# Altium schematic sheet STC智能车.SchDoc
size A2
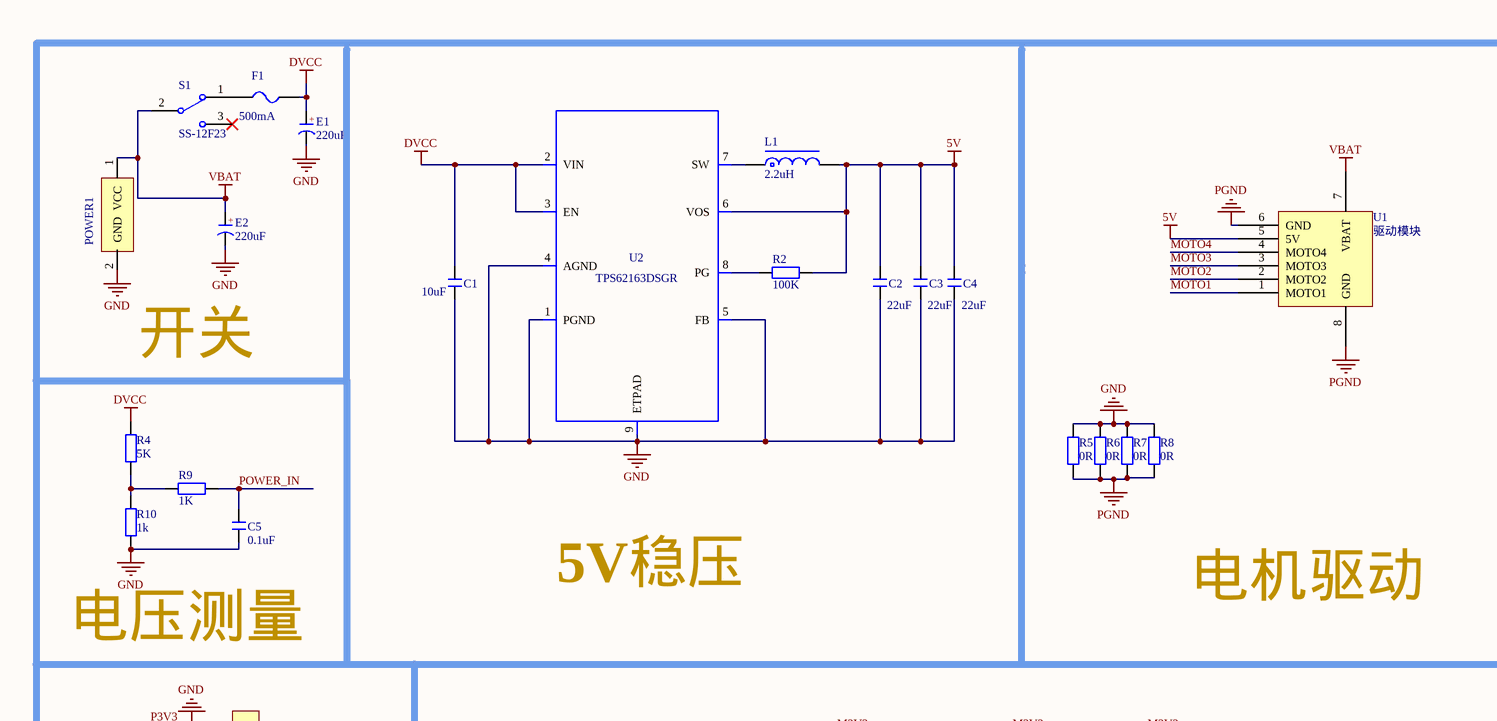
[diagram p0: STC智能车.SchDoc, top left]
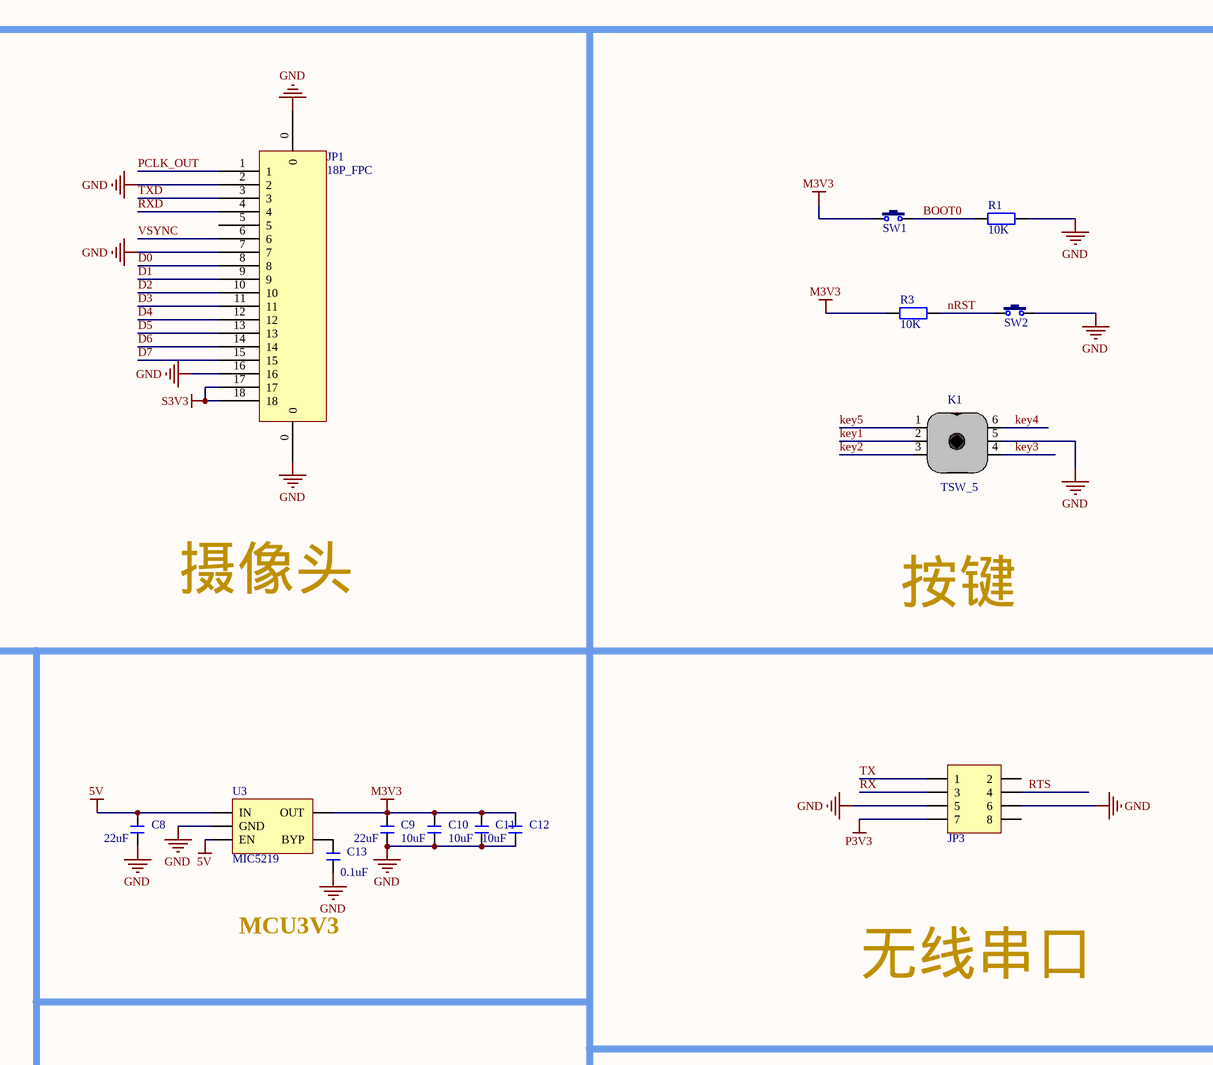
[diagram p1: STC智能车.SchDoc, top right]
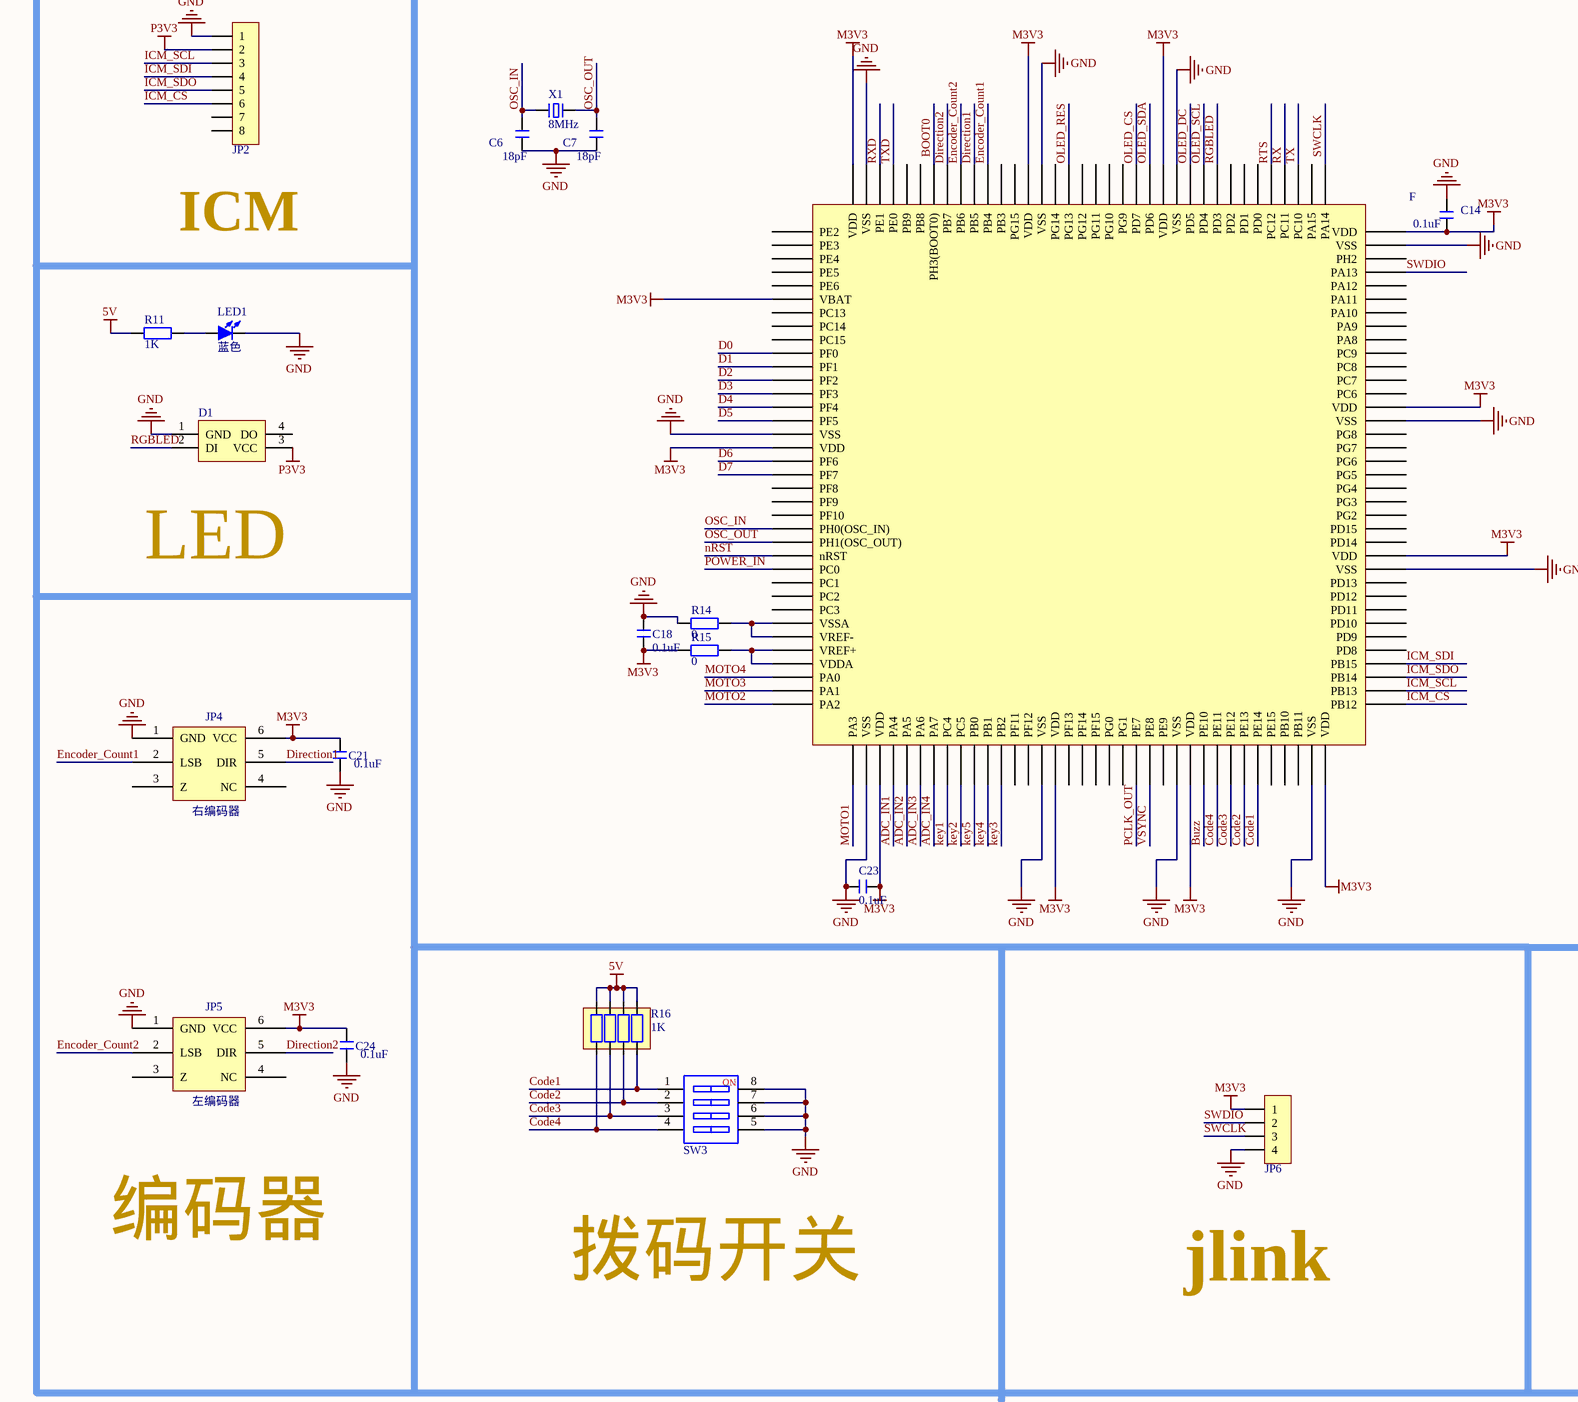
[diagram p2: STC智能车.SchDoc, bottom left]
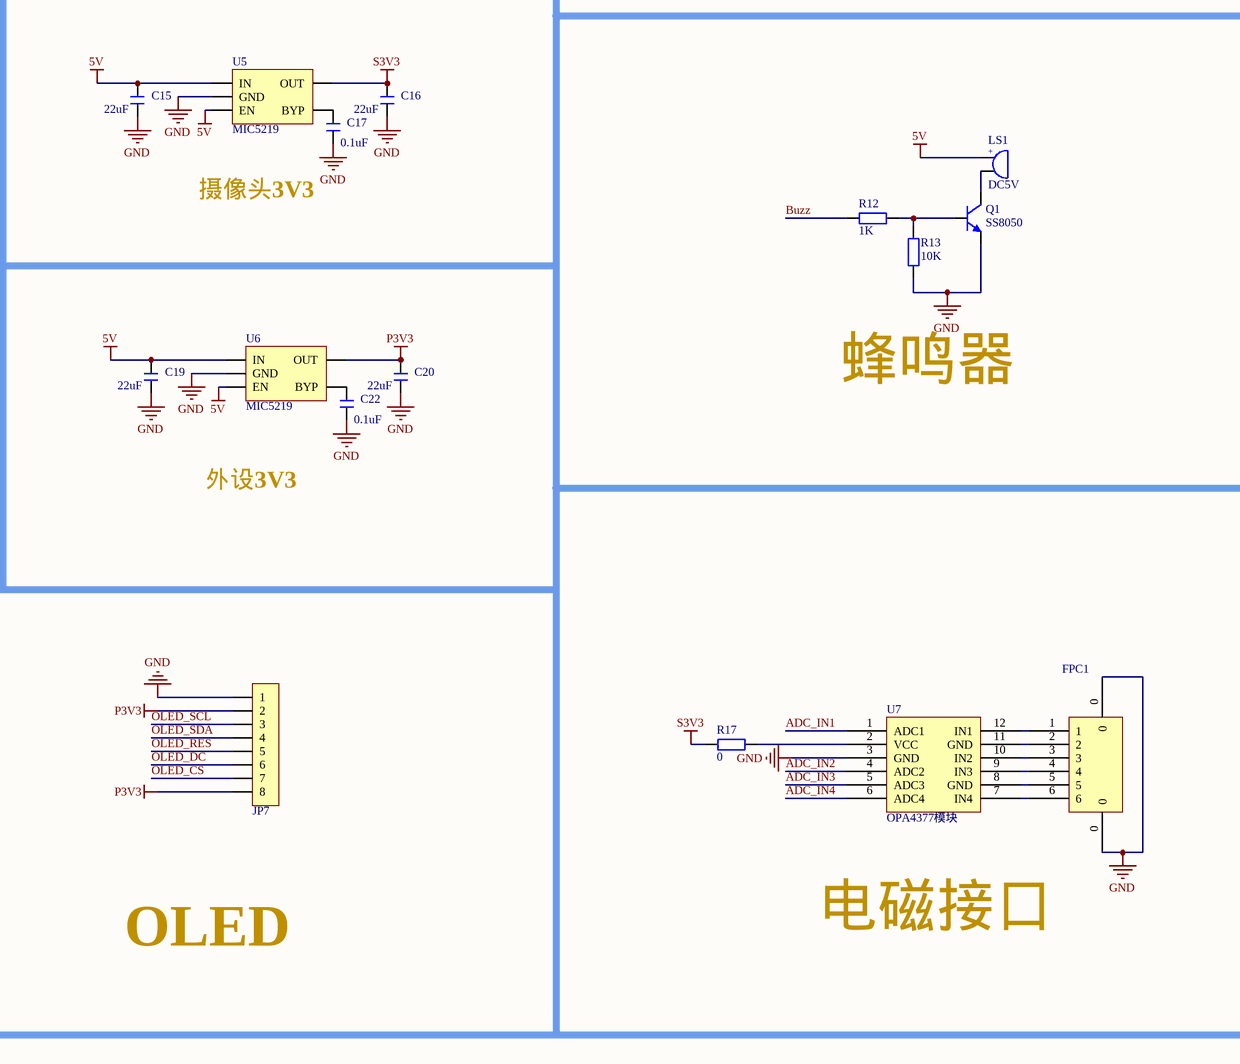
[diagram p3: STC智能车.SchDoc, bottom right]

## Parts
C1  10uF  [C 0805_M]
C2  22uF  [C 0805_M]
C3  22uF  [C 0805_M]
C4  22uF  [C 0805_M]
C5  0.1uF  [C 0805_M]
C6  18pF  [C 0805_M]
C7  18pF  [C 0805_M]
C8  22uF  [C 0805_M]
C9  22uF  [C 0805_M]
C10  10uF  [C 0805_M]
C11  10uF  [C 0805_M]
C12  10uF  [C 0805_M]
C13  0.1uF  [C 0805_M]
C14  0.1uF  [C 0805_M]
C15  22uF  [C 0805_M]
C16  22uF  [C 0805_M]
C17  0.1uF  [C 0805_M]
C18  0.1uF  [C 0805_M]
C19  22uF  [C 0805_M]
C20  22uF  [C 0805_M]
C21  0.1uF  [C 0805_M]
C22  0.1uF  [C 0805_M]
C23  0.1uF  [C 0805_M]
C24  0.1uF  [C 0805_M]
D1  P923D  [RGB_LED_5050]  (value not drawn)
E1  220uF  [CD D(7343)]
E2  220uF  [CD D(7343)]
F  MM32F3277  [LQFP144 20X20_M]  (value not drawn)
F1  500mA  [FU 0805]
FPC1  FPC_6PIN  [FPC0.5 2H-WS-6P]  (value not drawn)
JP1  18P_FPC  [FPC0.5 2H-WS-18P]
JP2  HDR-1X8  [XH2.54-WI-8P]  (value not drawn)
JP3  Header 4X2  [HDR2.54-LI-2x4P]  (value not drawn)
JP4  右编码器  [2*3牛插座]
JP5  左编码器  [2*3牛插座]
JP6  HDR-1X4  [XH2.54-WI-4P]  (value not drawn)
JP7  HDR-1X8  [IPS]  (value not drawn)
K1  TSW_5  [TSW-10]
L1  2.2uH  [CD52]
LED1  蓝色  [LED 0805B]
LS1  DC5V  [BEEP 5x9x5.5]
POWER1  (no value)  [T槽]
Q1  SS8050  [SOT23-3N]
R1  10K  [R 0805_M]
R2  value 100K  [R 0805_M]  (hidden comment: Res2)
R3  10K  [R 0805_M]
R4  value 5K  [R 0805_M]  (hidden comment: Res2)
R5  0R  [R 0805_M]
R6  0R  [R 0805_M]
R7  0R  [R 0805_M]
R8  0R  [R 0805_M]
R9  value 1K  [R 0805_M]  (hidden comment: Res2)
R10  value 1k  [R 0805_M]  (hidden comment: Res2)
R11  value 1K  [R 0805_M]  (hidden comment: Res2)
R12  1K  [R 0805_L]
R13  10K  [R 0805_L]
R14  0  [R 0805_M]
R15  0  [R 0805_M]
R16  1K  [RCA-8P4R-0603]
R17  0  [R 0805_L]
S1  SS-12F23  [SS-12D10]
SW1  3x6x5  [TSW SMD-3*6*2.5]  (value not drawn)
SW2  3x6x5  [TSW SMD-3*6*2.5]  (value not drawn)
SW3  SW-4P  [CSW DIP-4P]  (value not drawn)
U1  驱动模块  [电机驱动]
U2  TPS62163DSGR  [TPS62163]
U3  MIC5219  [SOT23-5M]
U5  MIC5219  [SOT23-5M]
U6  MIC5219  [SOT23-5M]
U7  OPA4377模块  [OPA4377模块]
X1  8MHz  [OSC 5032-2P]

## Nets
5V: C2.2 C3.2 C4.2 C8.2 C15.2 C19.2 L1.2 LS1.1 R2.1 R11.2 R16.5 R16.6 R16.7 R16.8 U1.5(5V) U2.6(VOS) U3.1(IN) U3.3(EN) U5.1(IN) U5.3(EN) U6.1(IN) U6.3(EN)
DVCC: C1.2 E1.1(A) F1.2 R4.2 U2.2(VIN) U2.3(EN)
GND: C1.1 C2.1 C3.1 C4.1 C5.1 C6.1 C7.1 C8.1 C9.1 C10.1 C11.1 C12.1 C13.1 C14.2 C15.1 C16.1 C17.1 C18.1 C19.1 C20.1 C21.1 C22.1 C23.1 C24.1 D1.1(GND) E1.2(K) E2.2(K) F.16(VSS) F.38(VSS) F.51(VSS) F.61(VSS) F.71(VSS) F.83(VSS) F.94(VSS) F.107(VSS) F.120(VSS) F.130(VSS) F.143(VSS) FPC1.0 JP1.0 JP1.2 JP1.7 JP1.16 JP2.1 JP3.5 JP3.6 JP4.1(GND) JP5.1(GND) JP6.4 JP7.1 K1.5 LED1.2(K) POWER1.2(GND) Q1.2(E) R1.2 R5.2 R6.2 R7.2 R8.2 R10.1 R13.1 R14.2 SW2.2 SW3.5 SW3.6 SW3.7 SW3.8 U2.1(PGND) U2.4(AGND) U2.5(FB) U2.9(ETPAD) U3.2(GND) U5.2(GND) U6.2(GND) U7.3(GND)
M3V3: C9.2 C10.2 C11.2 C12.2 C14.1 C18.2 C21.2 C23.2 C24.2 F.6(VBAT) F.17(VDD) F.39(VDD) F.52(VDD) F.62(VDD) F.72(VDD) F.84(VDD) F.95(VDD) F.108(VDD) F.121(VDD) F.131(VDD) F.144(VDD) JP4.6(VCC) JP5.6(VCC) JP6.1 R3.1 R15.2 SW1.1 U3.5(OUT)
P3V3: C20.2 D1.3(VCC) JP2.2 JP3.7 JP7.2 JP7.8 U6.5(OUT)
PGND: R5.1 R6.1 R7.1 R8.1 U1.6(GND) U1.8(GND)
S3V3: C16.2 JP1.17 JP1.18 R17.1 U5.5(OUT)
VBAT: E2.1(A) POWER1.1(VCC) S1.2 U1.7(VBAT)
ADC_IN1: F.40(PA4) U7.1(ADC1)
ADC_IN2: F.41(PA5) U7.4(ADC2)
ADC_IN3: F.42(PA6) U7.5(ADC3)
ADC_IN4: F.43(PA7) U7.6(ADC4)
BOOT0: F.138(PH3(BOOT0)) R1.1 SW1.2
Buzz: F.63(PE10) R12.2
Code1: F.67(PE14) R16.4 SW3.1
Code2: F.66(PE13) R16.3 SW3.2
Code3: F.65(PE12) R16.2 SW3.3
Code4: F.64(PE11) R16.1 SW3.4
D0: F.10(PF0) JP1.8
D1: F.11(PF1) JP1.9
D2: F.12(PF2) JP1.10
D3: F.13(PF3) JP1.11
D4: F.14(PF4) JP1.12
D5: F.15(PF5) JP1.13
D6: F.18(PF6) JP1.14
D7: F.19(PF7) JP1.15
Direction1: F.135(PB5) JP4.5(DIR)
Direction2: F.137(PB7) JP5.5(DIR)
Encoder_Count1: F.134(PB4) JP4.2(LSB)
Encoder_Count2: F.136(PB6) JP5.2(LSB)
ICM_CS: F.73(PB12) JP2.6
ICM_SCL: F.74(PB13) JP2.3
ICM_SDI: F.76(PB15) JP2.4
ICM_SDO: F.75(PB14) JP2.5
key1: F.44(PC4) K1.2
key2: F.45(PC5) K1.3
key3: F.48(PB2) K1.4
key4: F.47(PB1) K1.6
key5: F.46(PB0) K1.1
MOTO1: F.37(PA3) U1.1(MOTO1)
MOTO2: F.36(PA2) U1.2(MOTO2)
MOTO3: F.35(PA1) U1.3(MOTO3)
MOTO4: F.34(PA0) U1.4(MOTO4)
nRST: F.25(nRST) R3.2 SW2.1
OLED_CS: F.123(PD7) JP7.7
OLED_DC: F.119(PD5) JP7.6
OLED_RES: F.128(PG13) JP7.5
OLED_SCL: F.118(PD4) JP7.3
OLED_SDA: F.122(PD6) JP7.4
OSC_IN: C6.2 F.23(PH0(OSC_IN)) X1.1
OSC_OUT: C7.2 F.24(PH1(OSC_OUT)) X1.2
PCLK_OUT: F.58(PE7) JP1.1
POWER_IN: C5.2 F.26(PC0) R9.1
RGBLED: D1.2(DI) F.117(PD3)
RTS: F.113(PC12) JP3.4
RX: F.112(PC11) JP3.3
RXD: F.142(PE1) JP1.4
SWCLK: F.109(PA14) JP6.3
SWDIO: F.105(PA13) JP6.2
TX: F.111(PC10) JP3.1
TXD: F.141(PE0) JP1.3
VSYNC: F.59(PE8) JP1.6
NetC13_2: C13.2 U3.4(BYP)
NetC17_2: C17.2 U5.4(BYP)
NetC22_2: C22.2 U6.4(BYP)
NetF1_1: F1.1 S1.1
NetF_30: F.30(VSSA) F.31(VREF-) R14.1
NetF_32: F.32(VREF+) F.33(VDDA) R15.1
NetFPC1_1: FPC1.1 U7.12(IN1)
NetFPC1_2: FPC1.2 U7.11(GND)
NetFPC1_3: FPC1.3 U7.10(IN2)
NetFPC1_4: FPC1.4 U7.9(IN3)
NetFPC1_5: FPC1.5 U7.8(GND)
NetFPC1_6: FPC1.6 U7.7(IN4)
NetL1_1: L1.1 U2.7(SW)
NetLED1_1: LED1.1(A) R11.1
NetLS1_2: LS1.2 Q1.3(C)
NetQ1_1: Q1.1(B) R12.1 R13.2
NetR2_2: R2.2 U2.8(PG)
NetR4_1: R4.1 R9.2 R10.2
NetR17_2: R17.2 U7.2(VCC)

Not connected (* = marked no-connect by the designer): D1 4(DO); F 1(PE2) 2(PE3) 3(PE4) 4(PE5) 5(PE6) 7(PC13) 8(PC14) 9(PC15) 20(PF8) 21(PF9) 22(PF10) 27(PC1) 28(PC2) 29(PC3) 49(PF11) 50(PF12) 53(PF13) 54(PF14) 55(PF15) 56(PG0) 57(PG1) 60(PE9) 68(PE15) 69(PB10) 70(PB11) 77(PD8) 78(PD9) 79(PD10) 80(PD11) 81(PD12) 82(PD13) 85(PD14) 86(PD15) 87(PG2) 88(PG3) 89(PG4) 90(PG5) 91(PG6) 92(PG7) 93(PG8) 96(PC6) 97(PC7) 98(PC8) 99(PC9) 100(PA8) 101(PA9) 102(PA10) 103(PA11) 104(PA12) 106(PH2) 110(PA15) 114(PD0) 115(PD1) 116(PD2) 124(PG9) 125(PG10) 126(PG11) 127(PG12) 129(PG14) 132(PG15) 133(PB3) 139(PB8) 140(PB9); JP1 5; JP2 7 8; JP3 2 8; JP4 3(Z) 4(NC); JP5 3(Z) 4(NC); S1 3*

## Notes on the sheet
- 开关
- 5V稳压
- 电压测量
- 电机驱动
- 摄像头
- 按键
- (near JP2) ICM
- MCU3V3
- 无线串口
- (near D1) LED
- 摄像头3V3
- 蜂鸣器
- 外设3V3
- 编码器
- 拨码开关
- jlink
- OLED
- 电磁接口
- (in symbol BEEP) +
- (in symbol CT) +
- (in symbol SW-4P) NO

## Library data of the parts
C1-C24 = C: 贴片电容; BOM名称: 无极性贴片电容; 淘宝ID: 封装库来自淘宝 ID：黄晶宝石; 联系售后: https://shop463601444.taobao.com
E1 E2 = CT: 贴片钽电容; 淘宝ID: 封装库来自淘宝 ID：黄晶宝石; BOM名称: 贴片钽电容; 联系售后: https://shop463601444.taobao.com
F = MM32F3277: 灵动的MM32F3277
F1 = FU: 贴片保险丝; 版权归属: 源创客; BOM名称: 贴片保险丝; 学习资源: www.ooocke.com
JP2 JP7 = Header 8: 8P接插件; 版权归属: 封装库来自淘宝 ID：黄晶宝石; BOM名称: 8P接插件; 学习资源: https://shop463601444.taobao.com
JP3 = Header 4X2: 4*2P接插件; 版权归属: 封装库来自淘宝 ID：黄晶宝石; BOM名称: 4*2P接插件; 学习资源: https://shop463601444.taobao.com
JP4 JP5 = ENCODER
JP6 = Header 4: 4P接插件; 版权归属: 封装库来自淘宝 ID：黄晶宝石; BOM名称: 4P接插件; 学习资源: https://shop463601444.taobao.com
K1 = TSW_5: 方向开关
L1 = L-SMD: CD系列贴片线绕功率电感; BOM名称: 功率电感; 淘宝ID: 封装库来自淘宝 ID：黄晶宝石; 学习资源: www.ooocke.com
LED1 = LED-SMD: 贴片LED; 版权归属: 封装库来自淘宝 ID：黄晶宝石; BOM名称: 贴片LED; 学习资源: https://shop463601444.taobao.com
LS1 = BEEP: 蜂鸣器; 版权归属: 封装库来自淘宝 ID：黄晶宝石; BOM名称: 蜂鸣器; 联系售后: https://shop463601444.taobao.com
POWER1 = T槽
Q1 = 8050-SMD: 高频放大-NPN型; 版权归属: 封装库来自淘宝 ID：黄晶宝石; 属性: 40V 1.5A 1W 100MHZ; BOM名称: 高频放大-NPN型; 联系售后: https://shop463601444.taobao.com
R1 R3 R5-R8 R14 R15 = RES
R2 R4 R9-R11 = Res2: Resistor; Published: 8-Jun-2000; LatestRevisionDate: 17-Jul-2002; LatestRevisionNote: Re-released for DXP Platform.; PackageReference: AXIAL-0.4; Publisher: Altium Limited; PackageDescription: Axial Device, Thru-Hole; 2 Leads; 0.4 in Pin Spacing
R12 R13 R17 = R: 贴片电阻; 版权归属: 来自淘宝 ID：黄晶宝石; BOM名称: 贴片电阻; 联系售后: https://shop463601444.taobao.com
R16 = R-8P4R: 贴片排阻; BOM名称: 贴片网络排阻; 版权归属: 封装库来自淘宝 ID：黄晶宝石; 联系售后: https://shop463601444.taobao.com
S1 = SSW-1P: 1路波动开关; BOM名称: 波动开关; 版权归属: 封装库来自淘宝 ID：黄晶宝石; 学习资源: www.ooocke.com
SW1 SW2 = TSW 3x6: 3x6轻触开关; 版权归属: 封装库来自淘宝 ID：黄晶宝石; BOM名称: 3x6轻触开关; 学习资源: www.ooocke.com
SW3 = SW-4P: 4路编码开关; 淘宝ID: 封装库来自淘宝 ID：黄晶宝石; BOM名称: 4路编码开关; 学习资源: https://shop463601444.taobao.com
U2 = TPS62163DSGR: Manufacturer Name: Texas Instruments; PackageReference: TPS62163DSGR; Manufacturer Part Number: TPS62163DSGR; Value: N/A
X1 = XTAL-2P: 2脚无源脚晶振; 版权归属: 源创客; BOM名称: 2脚无源脚晶振; 学习资源: www.ooocke.com
D1 = P923D: Publisher: mazhongwei; Published: 8-August-2017; PackageReference: RGB_LED_5050